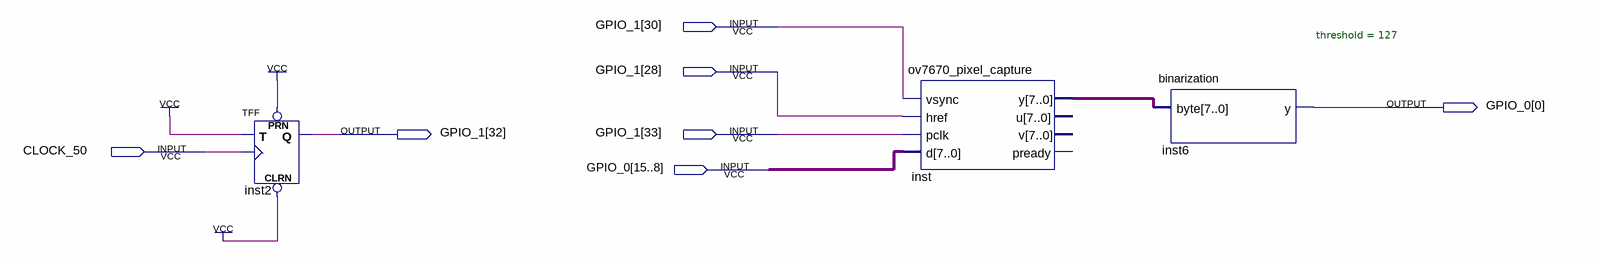
[diagram p0: schematic sheet]
// Quartus schematic cyclopes.bdf as structural Verilog: 3 symbols, 7 pins
module cyclopes (
  inout  [33:28] GPIO_1,
  input  CLOCK_50,
  inout  [15:0] GPIO_0
);

  wire [7:0] inst_y;

  TFF inst2 (.PRN(1'b1), .CLRN(1'b1), .T(1'b1), .CLK(CLOCK_50), .Q(GPIO_1[32]));
  ov7670_pixel_capture inst (
    .vsync(GPIO_1[30]), .href(GPIO_1[28]), .pclk(GPIO_1[33]), .d(GPIO_0[15:8]), .y(inst_y));  // open: u, v, pready
  binarization #(.threshold(127)) inst6 (.\byte (inst_y), .y(GPIO_0[0]));
endmodule
